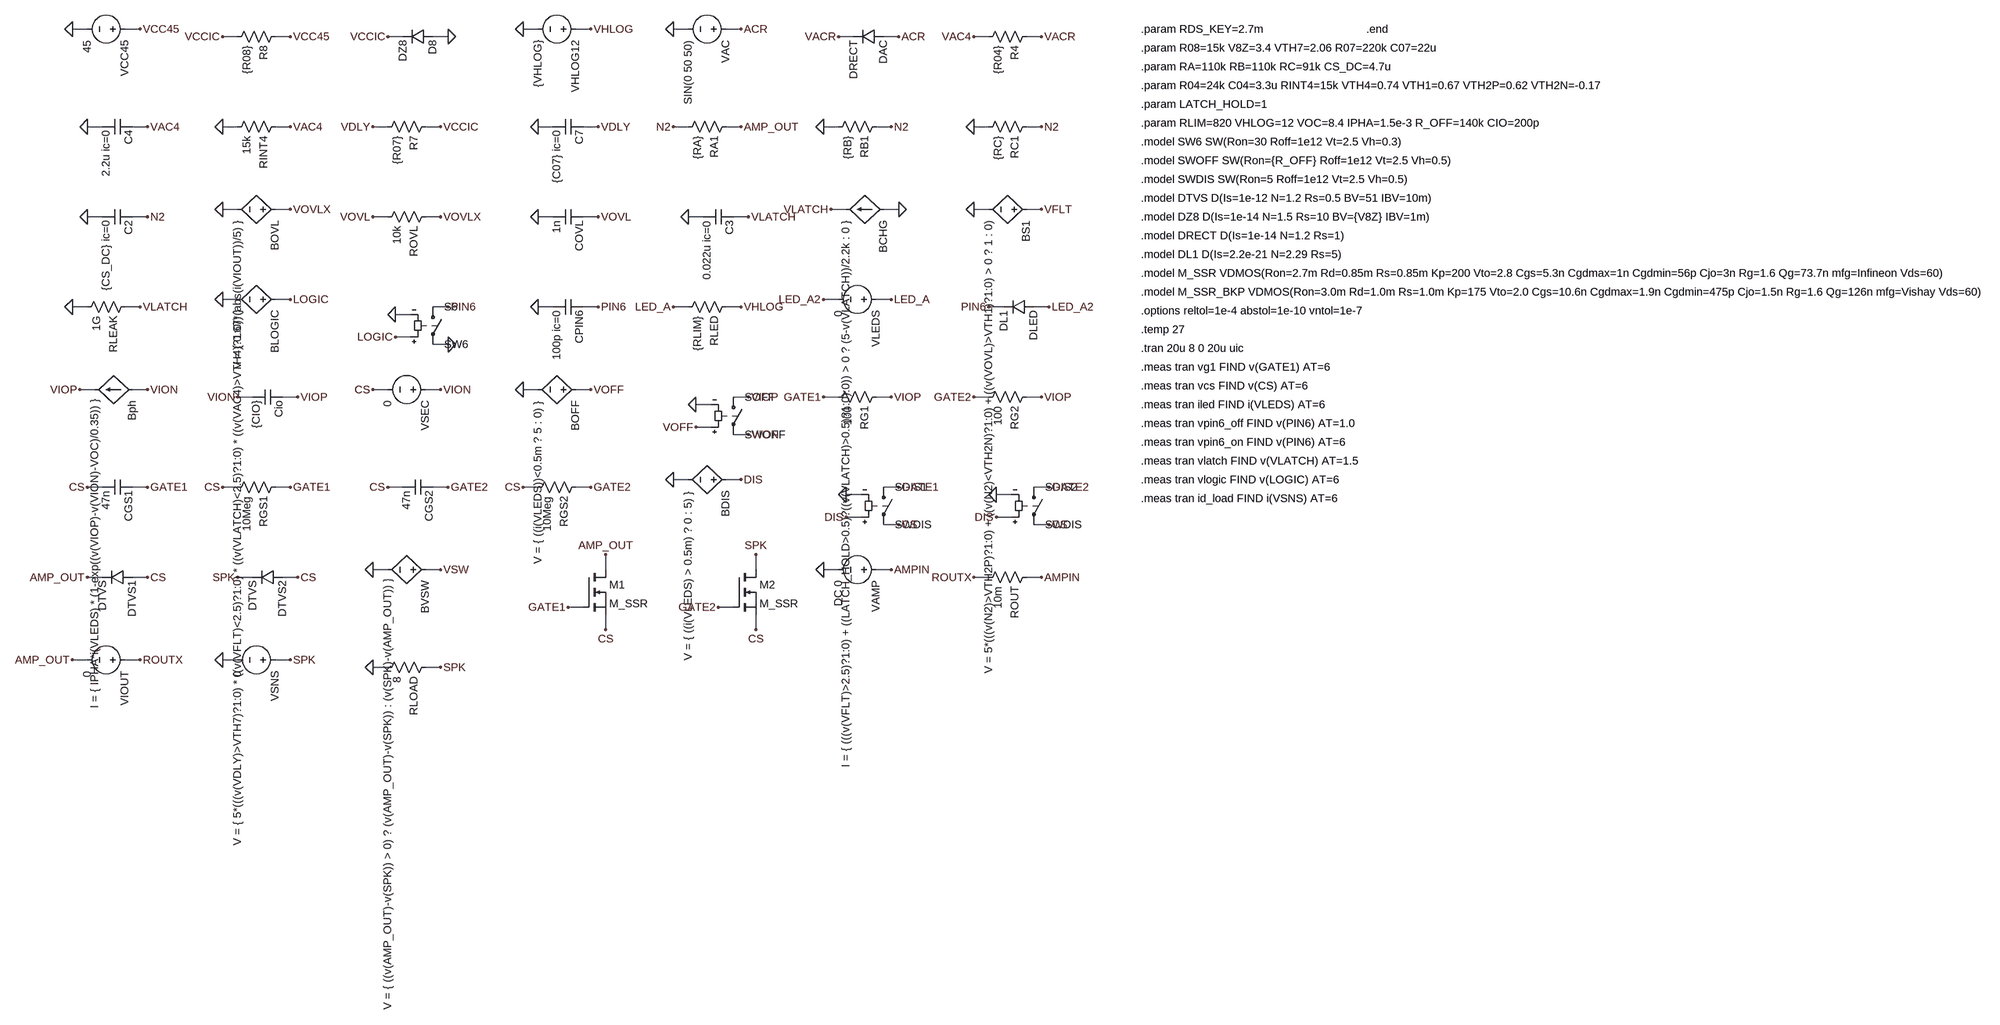
[diagram p0: schematic uPC1237_SSR.asc]
uPC1237_SSR.asc, the LTspice schematic file:
Version 4
SHEET 1 2800 1600
SYMBOL voltage 192 192 R90
SYMATTR InstName VCC45
SYMATTR Value 45
WIRE 176 192 208 192
WIRE 96 192 64 192
FLAG 208 192 VCC45
FLAG 64 192 0
SYMBOL res 512 192 R90
SYMATTR InstName R8
SYMATTR Value {R08}
WIRE 496 208 528 208
WIRE 416 208 384 208
FLAG 528 208 VCC45
FLAG 384 208 VCCIC
SYMBOL diode 832 192 R90
SYMATTR InstName D8
SYMATTR Value DZ8
WIRE 832 208 864 208
WIRE 768 208 736 208
FLAG 864 208 0
FLAG 736 208 VCCIC
SYMBOL voltage 1152 192 R90
SYMATTR InstName VHLOG12
SYMATTR Value {VHLOG}
WIRE 1136 192 1168 192
WIRE 1056 192 1024 192
FLAG 1168 192 VHLOG
FLAG 1024 192 0
SYMBOL voltage 1472 192 R90
SYMATTR InstName VAC
SYMATTR Value SIN(0 50 50)
WIRE 1456 192 1488 192
WIRE 1376 192 1344 192
FLAG 1488 192 ACR
FLAG 1344 192 0
SYMBOL diode 1792 192 R90
SYMATTR InstName DAC
SYMATTR Value DRECT
WIRE 1792 208 1824 208
WIRE 1728 208 1696 208
FLAG 1824 208 ACR
FLAG 1696 208 VACR
SYMBOL res 2112 192 R90
SYMATTR InstName R4
SYMATTR Value {R04}
WIRE 2096 208 2128 208
WIRE 2016 208 1984 208
FLAG 2128 208 VACR
FLAG 1984 208 VAC4
SYMBOL cap 192 384 R90
SYMATTR InstName C4
SYMATTR Value 2.2u ic=0
WIRE 192 400 224 400
WIRE 128 400 96 400
FLAG 224 400 VAC4
FLAG 96 400 0
SYMBOL res 512 384 R90
SYMATTR InstName RINT4
SYMATTR Value 15k
WIRE 496 400 528 400
WIRE 416 400 384 400
FLAG 528 400 VAC4
FLAG 384 400 0
SYMBOL res 832 384 R90
SYMATTR InstName R7
SYMATTR Value {R07}
WIRE 816 400 848 400
WIRE 736 400 704 400
FLAG 848 400 VCCIC
FLAG 704 400 VDLY
SYMBOL cap 1152 384 R90
SYMATTR InstName C7
SYMATTR Value {C07} ic=0
WIRE 1152 400 1184 400
WIRE 1088 400 1056 400
FLAG 1184 400 VDLY
FLAG 1056 400 0
SYMBOL res 1472 384 R90
SYMATTR InstName RA1
SYMATTR Value {RA}
WIRE 1456 400 1488 400
WIRE 1376 400 1344 400
FLAG 1488 400 AMP_OUT
FLAG 1344 400 N2
SYMBOL res 1792 384 R90
SYMATTR InstName RB1
SYMATTR Value {RB}
WIRE 1776 400 1808 400
WIRE 1696 400 1664 400
FLAG 1808 400 N2
FLAG 1664 400 0
SYMBOL res 2112 384 R90
SYMATTR InstName RC1
SYMATTR Value {RC}
WIRE 2096 400 2128 400
WIRE 2016 400 1984 400
FLAG 2128 400 N2
FLAG 1984 400 0
SYMBOL cap 192 576 R90
SYMATTR InstName C2
SYMATTR Value {CS_DC} ic=0
WIRE 192 592 224 592
WIRE 128 592 96 592
FLAG 224 592 N2
FLAG 96 592 0
SYMBOL bv 512 576 R90
SYMATTR InstName BOVL
SYMATTR Value V = { 0.67*(abs(i(VIOUT))/5) }
WIRE 496 576 528 576
WIRE 416 576 384 576
FLAG 528 576 VOVLX
FLAG 384 576 0
SYMBOL res 832 576 R90
SYMATTR InstName ROVL
SYMATTR Value 10k
WIRE 816 592 848 592
WIRE 736 592 704 592
FLAG 848 592 VOVLX
FLAG 704 592 VOVL
SYMBOL cap 1152 576 R90
SYMATTR InstName COVL
SYMATTR Value 1n
WIRE 1152 592 1184 592
WIRE 1088 592 1056 592
FLAG 1184 592 VOVL
FLAG 1056 592 0
SYMBOL cap 1472 576 R90
SYMATTR InstName C3
SYMATTR Value 0.022u ic=0
WIRE 1472 592 1504 592
WIRE 1408 592 1376 592
FLAG 1504 592 VLATCH
FLAG 1376 592 0
SYMBOL bi 1792 576 R90
SYMATTR InstName BCHG
SYMATTR Value I = { (((v(VFLT)>2.5)?1:0) + ((LATCH_HOLD>0.5)?((v(VLATCH)>0.5)?1:0):0)) > 0 ? (5-v(VLATCH))/2.2k : 0 }
WIRE 1792 576 1824 576
WIRE 1712 576 1680 576
FLAG 1824 576 0
FLAG 1680 576 VLATCH
SYMBOL bv 2112 576 R90
SYMATTR InstName BS1
SYMATTR Value V = 5*(((v(N2)>VTH2P)?1:0) + ((v(N2)<VTH2N)?1:0) + ((v(VOVL)>VTH1)?1:0) > 0 ? 1 : 0)
WIRE 2096 576 2128 576
WIRE 2016 576 1984 576
FLAG 2128 576 VFLT
FLAG 1984 576 0
SYMBOL res 192 768 R90
SYMATTR InstName RLEAK
SYMATTR Value 1G
WIRE 176 784 208 784
WIRE 96 784 64 784
FLAG 208 784 VLATCH
FLAG 64 784 0
SYMBOL bv 512 768 R90
SYMATTR InstName BLOGIC
SYMATTR Value V = { 5*(((v(VDLY)>VTH7)?1:0) * ((v(VFLT)<2.5)?1:0) * ((v(VLATCH)<2.5)?1:0) * ((v(VAC4)>VTH4)?1:0)) }
WIRE 496 768 528 768
WIRE 416 768 384 768
FLAG 528 768 LOGIC
FLAG 384 768 0
SYMBOL sw 832 768 R0
SYMATTR InstName S6
SYMATTR Value SW6
WIRE 832 784 864 784
WIRE 832 864 864 864
WIRE 784 848 752 848
WIRE 784 800 752 800
FLAG 864 784 PIN6
FLAG 864 864 0
FLAG 752 848 LOGIC
FLAG 752 800 0
SYMBOL cap 1152 768 R90
SYMATTR InstName CPIN6
SYMATTR Value 100p ic=0
WIRE 1152 784 1184 784
WIRE 1088 784 1056 784
FLAG 1184 784 PIN6
FLAG 1056 784 0
SYMBOL res 1472 768 R90
SYMATTR InstName RLED
SYMATTR Value {RLIM}
WIRE 1456 784 1488 784
WIRE 1376 784 1344 784
FLAG 1488 784 VHLOG
FLAG 1344 784 LED_A
SYMBOL voltage 1792 768 R90
SYMATTR InstName VLEDS
SYMATTR Value 0
WIRE 1776 768 1808 768
WIRE 1696 768 1664 768
FLAG 1808 768 LED_A
FLAG 1664 768 LED_A2
SYMBOL diode 2112 768 R90
SYMATTR InstName DLED
SYMATTR Value DL1
WIRE 2112 784 2144 784
WIRE 2048 784 2016 784
FLAG 2144 784 LED_A2
FLAG 2016 784 PIN6
SYMBOL bi 192 960 R90
SYMATTR InstName Bph
SYMATTR Value I = { IPHA*i(VLEDS) * (1-exp((v(VIOP)-v(VION)-VOC)/0.35)) }
WIRE 192 960 224 960
WIRE 112 960 80 960
FLAG 224 960 VION
FLAG 80 960 VIOP
SYMBOL cap 512 960 R90
SYMATTR InstName Cio
SYMATTR Value {CIO}
WIRE 512 976 544 976
WIRE 448 976 416 976
FLAG 544 976 VIOP
FLAG 416 976 VION
SYMBOL voltage 832 960 R90
SYMATTR InstName VSEC
SYMATTR Value 0
WIRE 816 960 848 960
WIRE 736 960 704 960
FLAG 848 960 VION
FLAG 704 960 CS
SYMBOL bv 1152 960 R90
SYMATTR InstName BOFF
SYMATTR Value V = { ((i(VLEDS))<0.5m ? 5 : 0) }
WIRE 1136 960 1168 960
WIRE 1056 960 1024 960
FLAG 1168 960 VOFF
FLAG 1024 960 0
SYMBOL sw 1472 960 R0
SYMATTR InstName SOFF
SYMATTR Value SWOFF
WIRE 1472 976 1504 976
WIRE 1472 1056 1504 1056
WIRE 1424 1040 1392 1040
WIRE 1424 992 1392 992
FLAG 1504 976 VIOP
FLAG 1504 1056 VION
FLAG 1392 1040 VOFF
FLAG 1392 992 0
SYMBOL res 1792 960 R90
SYMATTR InstName RG1
SYMATTR Value 100
WIRE 1776 976 1808 976
WIRE 1696 976 1664 976
FLAG 1808 976 VIOP
FLAG 1664 976 GATE1
SYMBOL res 2112 960 R90
SYMATTR InstName RG2
SYMATTR Value 100
WIRE 2096 976 2128 976
WIRE 2016 976 1984 976
FLAG 2128 976 VIOP
FLAG 1984 976 GATE2
SYMBOL cap 192 1152 R90
SYMATTR InstName CGS1
SYMATTR Value 47n
WIRE 192 1168 224 1168
WIRE 128 1168 96 1168
FLAG 224 1168 GATE1
FLAG 96 1168 CS
SYMBOL res 512 1152 R90
SYMATTR InstName RGS1
SYMATTR Value 10Meg
WIRE 496 1168 528 1168
WIRE 416 1168 384 1168
FLAG 528 1168 GATE1
FLAG 384 1168 CS
SYMBOL cap 832 1152 R90
SYMATTR InstName CGS2
SYMATTR Value 47n
WIRE 832 1168 864 1168
WIRE 768 1168 736 1168
FLAG 864 1168 GATE2
FLAG 736 1168 CS
SYMBOL res 1152 1152 R90
SYMATTR InstName RGS2
SYMATTR Value 10Meg
WIRE 1136 1168 1168 1168
WIRE 1056 1168 1024 1168
FLAG 1168 1168 GATE2
FLAG 1024 1168 CS
SYMBOL bv 1472 1152 R90
SYMATTR InstName BDIS
SYMATTR Value V = { ((i(VLEDS) > 0.5m) ? 0 : 5) }
WIRE 1456 1152 1488 1152
WIRE 1376 1152 1344 1152
FLAG 1488 1152 DIS
FLAG 1344 1152 0
SYMBOL sw 1792 1152 R0
SYMATTR InstName SDIS1
SYMATTR Value SWDIS
WIRE 1792 1168 1824 1168
WIRE 1792 1248 1824 1248
WIRE 1744 1232 1712 1232
WIRE 1744 1184 1712 1184
FLAG 1824 1168 GATE1
FLAG 1824 1248 CS
FLAG 1712 1232 DIS
FLAG 1712 1184 0
SYMBOL sw 2112 1152 R0
SYMATTR InstName SDIS2
SYMATTR Value SWDIS
WIRE 2112 1168 2144 1168
WIRE 2112 1248 2144 1248
WIRE 2064 1232 2032 1232
WIRE 2064 1184 2032 1184
FLAG 2144 1168 GATE2
FLAG 2144 1248 CS
FLAG 2032 1232 DIS
FLAG 2032 1184 0
SYMBOL diode 192 1344 R90
SYMATTR InstName DTVS1
SYMATTR Value DTVS
WIRE 192 1360 224 1360
WIRE 128 1360 96 1360
FLAG 224 1360 CS
FLAG 96 1360 AMP_OUT
SYMBOL diode 512 1344 R90
SYMATTR InstName DTVS2
SYMATTR Value DTVS
WIRE 512 1360 544 1360
WIRE 448 1360 416 1360
FLAG 544 1360 CS
FLAG 416 1360 SPK
SYMBOL bv 832 1344 R90
SYMATTR InstName BVSW
SYMATTR Value V = { ((v(AMP_OUT)-v(SPK)) > 0) ? (v(AMP_OUT)-v(SPK)) : (v(SPK)-v(AMP_OUT)) }
WIRE 816 1344 848 1344
WIRE 736 1344 704 1344
FLAG 848 1344 VSW
FLAG 704 1344 0
SYMBOL nmos 1152 1344 R0
SYMATTR InstName M1
SYMATTR Value M_SSR
WIRE 1200 1344 1200 1312
WIRE 1152 1424 1120 1424
WIRE 1200 1440 1200 1472
FLAG 1200 1312 AMP_OUT
FLAG 1120 1424 GATE1
FLAG 1200 1472 CS
SYMBOL nmos 1472 1344 R0
SYMATTR InstName M2
SYMATTR Value M_SSR
WIRE 1520 1344 1520 1312
WIRE 1472 1424 1440 1424
WIRE 1520 1440 1520 1472
FLAG 1520 1312 SPK
FLAG 1440 1424 GATE2
FLAG 1520 1472 CS
SYMBOL voltage 1792 1344 R90
SYMATTR InstName VAMP
SYMATTR Value DC 0
WIRE 1776 1344 1808 1344
WIRE 1696 1344 1664 1344
FLAG 1808 1344 AMPIN
FLAG 1664 1344 0
SYMBOL res 2112 1344 R90
SYMATTR InstName ROUT
SYMATTR Value 10m
WIRE 2096 1360 2128 1360
WIRE 2016 1360 1984 1360
FLAG 2128 1360 AMPIN
FLAG 1984 1360 ROUTX
SYMBOL voltage 192 1536 R90
SYMATTR InstName VIOUT
SYMATTR Value 0
WIRE 176 1536 208 1536
WIRE 96 1536 64 1536
FLAG 208 1536 ROUTX
FLAG 64 1536 AMP_OUT
SYMBOL voltage 512 1536 R90
SYMATTR InstName VSNS
SYMATTR Value 0
WIRE 496 1536 528 1536
WIRE 416 1536 384 1536
FLAG 528 1536 SPK
FLAG 384 1536 0
SYMBOL res 832 1536 R90
SYMATTR InstName RLOAD
SYMATTR Value 8
WIRE 816 1552 848 1552
WIRE 736 1552 704 1552
FLAG 848 1552 SPK
FLAG 704 1552 0
TEXT 2400 192 Left 2 !.param RDS_KEY=2.7m
TEXT 2400 232 Left 2 !.param R08=15k V8Z=3.4 VTH7=2.06 R07=220k C07=22u
TEXT 2400 272 Left 2 !.param RA=110k RB=110k RC=91k CS_DC=4.7u
TEXT 2400 312 Left 2 !.param R04=24k C04=3.3u RINT4=15k VTH4=0.74 VTH1=0.67 VTH2P=0.62 VTH2N=-0.17
TEXT 2400 352 Left 2 !.param LATCH_HOLD=1
TEXT 2400 392 Left 2 !.param RLIM=820 VHLOG=12 VOC=8.4 IPHA=1.5e-3 R_OFF=140k CIO=200p
TEXT 2400 432 Left 2 !.model SW6 SW(Ron=30 Roff=1e12 Vt=2.5 Vh=0.3)
TEXT 2400 472 Left 2 !.model SWOFF SW(Ron={R_OFF} Roff=1e12 Vt=2.5 Vh=0.5)
TEXT 2400 512 Left 2 !.model SWDIS SW(Ron=5 Roff=1e12 Vt=2.5 Vh=0.5)
TEXT 2400 552 Left 2 !.model DTVS D(Is=1e-12 N=1.2 Rs=0.5 BV=51 IBV=10m)
TEXT 2400 592 Left 2 !.model DZ8 D(Is=1e-14 N=1.5 Rs=10 BV={V8Z} IBV=1m)
TEXT 2400 632 Left 2 !.model DRECT D(Is=1e-14 N=1.2 Rs=1)
TEXT 2400 672 Left 2 !.model DL1 D(Is=2.2e-21 N=2.29 Rs=5)
TEXT 2400 712 Left 2 !.model M_SSR VDMOS(Ron=2.7m Rd=0.85m Rs=0.85m Kp=200 Vto=2.8 Cgs=5.3n Cgdmax=1n Cgdmin=56p Cjo=3n Rg=1.6 Qg=73.7n mfg=Infineon Vds=60)
TEXT 2400 752 Left 2 !.model M_SSR_BKP VDMOS(Ron=3.0m Rd=1.0m Rs=1.0m Kp=175 Vto=2.0 Cgs=10.6n Cgdmax=1.9n Cgdmin=475p Cjo=1.5n Rg=1.6 Qg=126n mfg=Vishay Vds=60)
TEXT 2400 792 Left 2 !.options reltol=1e-4 abstol=1e-10 vntol=1e-7
TEXT 2400 832 Left 2 !.temp 27
TEXT 2400 872 Left 2 !.tran 20u 8 0 20u uic
TEXT 2400 912 Left 2 !.meas tran vg1 FIND v(GATE1) AT=6
TEXT 2400 952 Left 2 !.meas tran vcs FIND v(CS) AT=6
TEXT 2400 992 Left 2 !.meas tran iled FIND i(VLEDS) AT=6
TEXT 2400 1032 Left 2 !.meas tran vpin6_off FIND v(PIN6) AT=1.0
TEXT 2400 1072 Left 2 !.meas tran vpin6_on FIND v(PIN6) AT=6
TEXT 2400 1112 Left 2 !.meas tran vlatch FIND v(VLATCH) AT=1.5
TEXT 2400 1152 Left 2 !.meas tran vlogic FIND v(LOGIC) AT=6
TEXT 2400 1192 Left 2 !.meas tran id_load FIND i(VSNS) AT=6
TEXT 2880 192 Left 2 !.end

The netlist it stands for:
* uPC1237_SSR.asc
VCC45 VCC45 0 45
R8 VCC45 VCCIC {R08}
D8 0 VCCIC DZ8
VHLOG12 VHLOG 0 {VHLOG}
VAC ACR 0 SIN(0 50 50)
DAC ACR VACR DRECT
R4 VACR VAC4 {R04}
C4 VAC4 0 2.2u ic=0
RINT4 VAC4 0 15k
R7 VCCIC VDLY {R07}
C7 VDLY 0 {C07} ic=0
RA1 AMP_OUT N2 {RA}
RB1 N2 0 {RB}
RC1 N2 0 {RC}
C2 N2 0 {CS_DC} ic=0
BOVL VOVLX 0 V = { 0.67*(abs(i(VIOUT))/5) }
ROVL VOVLX VOVL 10k
COVL VOVL 0 1n
C3 VLATCH 0 0.022u ic=0
BCHG 0 VLATCH I = { (((v(VFLT)>2.5)?1:0) + ((LATCH_HOLD>0.5)?((v(VLATCH)>0.5)?1:0):0)) > 0 ? (5-v(VLATCH))/2.2k : 0 }
BS1 VFLT 0 V = 5*(((v(N2)>VTH2P)?1:0) + ((v(N2)<VTH2N)?1:0) + ((v(VOVL)>VTH1)?1:0) > 0 ? 1 : 0)
RLEAK VLATCH 0 1G
BLOGIC LOGIC 0 V = { 5*(((v(VDLY)>VTH7)?1:0) * ((v(VFLT)<2.5)?1:0) * ((v(VLATCH)<2.5)?1:0) * ((v(VAC4)>VTH4)?1:0)) }
S6 PIN6 0 LOGIC 0 SW6
CPIN6 PIN6 0 100p ic=0
RLED VHLOG LED_A {RLIM}
VLEDS LED_A LED_A2 0
DLED LED_A2 PIN6 DL1
Bph VION VIOP I = { IPHA*i(VLEDS) * (1-exp((v(VIOP)-v(VION)-VOC)/0.35)) }
Cio VIOP VION {CIO}
VSEC VION CS 0
BOFF VOFF 0 V = { ((i(VLEDS))<0.5m ? 5 : 0) }
SOFF VIOP VION VOFF 0 SWOFF
RG1 VIOP GATE1 100
RG2 VIOP GATE2 100
CGS1 GATE1 CS 47n
RGS1 GATE1 CS 10Meg
CGS2 GATE2 CS 47n
RGS2 GATE2 CS 10Meg
BDIS DIS 0 V = { ((i(VLEDS) > 0.5m) ? 0 : 5) }
SDIS1 GATE1 CS DIS 0 SWDIS
SDIS2 GATE2 CS DIS 0 SWDIS
DTVS1 CS AMP_OUT DTVS
DTVS2 CS SPK DTVS
BVSW VSW 0 V = { ((v(AMP_OUT)-v(SPK)) > 0) ? (v(AMP_OUT)-v(SPK)) : (v(SPK)-v(AMP_OUT)) }
M1 AMP_OUT GATE1 CS CS M_SSR
M2 SPK GATE2 CS CS M_SSR
VAMP AMPIN 0 DC 0
ROUT AMPIN ROUTX 10m
VIOUT ROUTX AMP_OUT 0
VSNS SPK 0 0
RLOAD SPK 0 8
.model D D
.lib standard.dio
.model NMOS NMOS
.model PMOS PMOS
.lib standard.mos
.param RDS_KEY=2.7m
.param R08=15k V8Z=3.4 VTH7=2.06 R07=220k C07=22u
.param RA=110k RB=110k RC=91k CS_DC=4.7u
.param R04=24k C04=3.3u RINT4=15k VTH4=0.74 VTH1=0.67 VTH2P=0.62 VTH2N=-0.17
.param LATCH_HOLD=1
.param RLIM=820 VHLOG=12 VOC=8.4 IPHA=1.5e-3 R_OFF=140k CIO=200p
.model SW6 SW(Ron=30 Roff=1e12 Vt=2.5 Vh=0.3)
.model SWOFF SW(Ron={R_OFF} Roff=1e12 Vt=2.5 Vh=0.5)
.model SWDIS SW(Ron=5 Roff=1e12 Vt=2.5 Vh=0.5)
.model DTVS D(Is=1e-12 N=1.2 Rs=0.5 BV=51 IBV=10m)
.model DZ8 D(Is=1e-14 N=1.5 Rs=10 BV={V8Z} IBV=1m)
.model DRECT D(Is=1e-14 N=1.2 Rs=1)
.model DL1 D(Is=2.2e-21 N=2.29 Rs=5)
.model M_SSR VDMOS(Ron=2.7m Rd=0.85m Rs=0.85m Kp=200 Vto=2.8 Cgs=5.3n Cgdmax=1n Cgdmin=56p Cjo=3n Rg=1.6 Qg=73.7n mfg=Infineon Vds=60)
.model M_SSR_BKP VDMOS(Ron=3.0m Rd=1.0m Rs=1.0m Kp=175 Vto=2.0 Cgs=10.6n Cgdmax=1.9n Cgdmin=475p Cjo=1.5n Rg=1.6 Qg=126n mfg=Vishay Vds=60)
.options reltol=1e-4 abstol=1e-10 vntol=1e-7
.temp 27
.tran 20u 8 0 20u uic
.meas tran vg1 FIND v(GATE1) AT=6
.meas tran vcs FIND v(CS) AT=6
.meas tran iled FIND i(VLEDS) AT=6
.meas tran vpin6_off FIND v(PIN6) AT=1.0
.meas tran vpin6_on FIND v(PIN6) AT=6
.meas tran vlatch FIND v(VLATCH) AT=1.5
.meas tran vlogic FIND v(LOGIC) AT=6
.meas tran id_load FIND i(VSNS) AT=6
.end
.backanno
.end